# Altium project mightyFan.PrjPCB
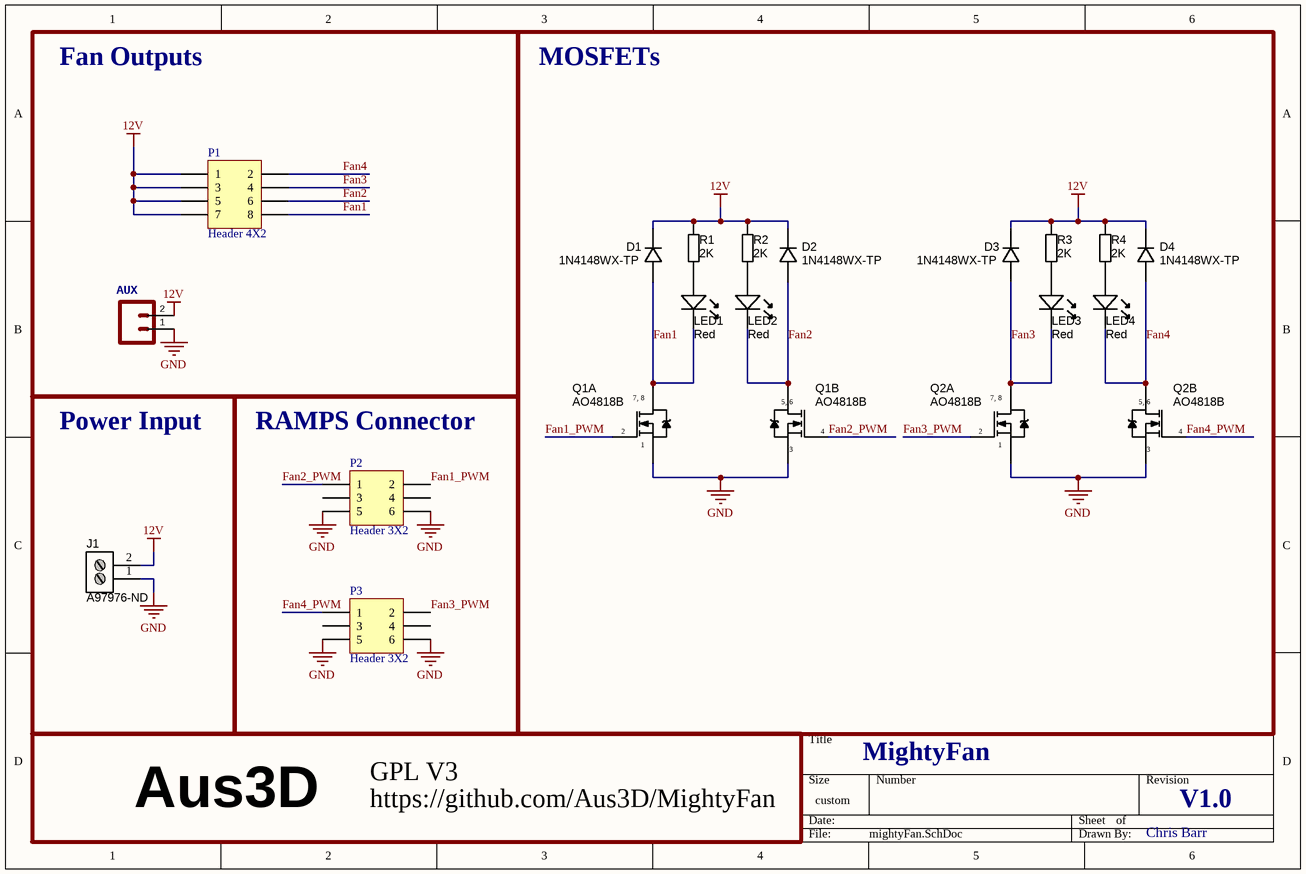
[diagram p0: mightyFan.SchDoc]
1 sheet, 19 parts. Net scope: global (net labels, ports and power ports of the same name join across sheets).
Board file: mightyFan.PcbDoc

## Sheet mightyFan.SchDoc
size 243 x 162 mm; PageSetup: Record=PageOptions|CenterHorizontal=True|CenterVertical=True|PrintScale=1.13|XCorrection=1.00|YCorrection=1.00|PrintKind=0|BorderSize=5000000|LeftOffset=0|BottomOffset=0|Orientation=2|PaperLength=1000|PaperWidth=1000|Scale=100|PaperSource=7|PrintQuality=-3|MediaType=1|DitherType=10|PrintScaleMode=1|PaperKind=Letter|PaperIndex=1

### Parts
AUX  Standard 2-pin 0.1" header. Use with  - straight break away headers ( PRT-00116) - right angle break away headers (PRT-00553) - swiss pins (PRT-00743) - machine pins (PRT-00117) - female headers (PRT-00115)   Molex polarized connector foot print use with: PRT-08233 with associated crimp pins and housings.  2.54_SCREWTERM for use with  PRT-10571.  3.5mm Screw Terminal footprints for  PRT-08084  5mm Screw Terminal footprints for use with PRT-08432  [1X02]  (value not drawn)
D1  Manufacturer Part Number: 1N4148WX-TP  [SOD323]  (hidden comment: DIODE_75V_500mW)
D2  Manufacturer Part Number: 1N4148WX-TP  [SOD323]  (hidden comment: DIODE_75V_500mW)
D3  Manufacturer Part Number: 1N4148WX-TP  [SOD323]  (hidden comment: DIODE_75V_500mW)
D4  Manufacturer Part Number: 1N4148WX-TP  [SOD323]  (hidden comment: DIODE_75V_500mW)
J1  Supplier Part Number 1: A97976-ND  [2P_PCB_ScrewTerm_90S_3.81MM]  (hidden comment: Stackable ScrewTerm)
LED1  Red  [LED-0603-RED]
LED2  Red  [LED-0603-RED]
LED3  Red  [LED-0603-RED]
LED4  Red  [LED-0603-RED]
P1  Header 4X2  [2X4]
P2  Header 3X2  [Header-3x2-female]
P3  Header 3X2  [Header-3x2-female]
Q1  Manufacturer Part Number 1: AO4818B  [SOIC127P600X175-8AN]  (hidden comment: MOSFET_AO4818B)  (parts A,B of 2)
Q2  Manufacturer Part Number 1: AO4818B  [SOIC127P600X175-8AN]  (hidden comment: MOSFET_AO4818B)  (parts A,B of 2)
R1  value 2K  [RESC1608X55N]  (hidden comment: Thick Film)
R2  value 2K  [RESC1608X55N]  (hidden comment: Thick Film)
R3  value 2K  [RESC1608X55N]  (hidden comment: Thick Film)
R4  value 2K  [RESC1608X55N]  (hidden comment: Thick Film)

### Blocks framed on the sheet
Fan Outputs: AUX P1
MOSFETs: D1-D4 LED1-LED4 Q1 Q2 R1-R4
Power Input: J1
RAMPS Connector: P2 P3

### Nets
12V: AUX.2 D1.K D2.K D3.K D4.K J1.2 P1.1 P1.3 P1.5 P1.7 R1.1 R2.1 R3.1 R4.1
GND: AUX.1 J1.1 P2.5 P2.6 P3.5 P3.6 Q1.1(S) Q1.3(S) Q2.1(S) Q2.3(S)
Fan1: D1.A LED1.K P1.8 Q1.7(D) Q1.8(D)
Fan1_PWM: P2.2 Q1.2(G)
Fan2: D2.A LED2.K P1.6 Q1.5(D) Q1.6(D)
Fan2_PWM: P2.1 Q1.4(G)
Fan3: D3.A LED3.K P1.4 Q2.7(D) Q2.8(D)
Fan3_PWM: P3.2 Q2.2(G)
Fan4: D4.A LED4.K P1.2 Q2.5(D) Q2.6(D)
Fan4_PWM: P3.1 Q2.4(G)
NetLED1_A: LED1.A R1.2
NetLED2_A: LED2.A R2.2
NetLED3_A: LED3.A R3.2
NetLED4_A: LED4.A R4.2

Not connected (* = marked no-connect by the designer): P2 3 4; P3 3 4

### Notes on the sheet
- MightyFan
- Aus3D
- https://github.com/Aus3D/MightyFan
- GPL V3
- V1.0
- Chris Barr
- (in symbol MOSFET_AO4818B, part A) 7, 8
- (in symbol MOSFET_AO4818B, part B) 5, 6

### Library data of the parts
AUX = M02PTH
D1-D4 = DIODE_75V_500mW: Diode SMD 300mA 0.5W SOD323; Manufacturer: Micro Commercial Co; Ratings: 75V; 300mA; 0.5W; Material: Si; Diode Type: Standard; Value: Vf=1V @ 50mA; SCDType: source; Package / Case: SOD323; Supplier 1: Digi-Key; Supplier Part Number 1: 1N4148WXTPMSCT-ND
J1 = 2P_ScrewTerm_90S_3.81MM: Terminal Block Screw Type THT 2-Position 3.81mm pitch; Manufacturer 1: Tyco Electronics; Manufacturer Part Number 1: 1776113-2; Value: 2 position; Pitch: 0.150" (3.81mm); Positions Per Level: 2; SCDType: undef; Package / Case: Side Entry; 3.81mm pitch; Category: Connectors Interconnects; Color: Black; Supplier 1: Digi-Key
LED1-LED4 = LED_SMD_Red_0603_220mcd: LED 0603 SMD Hyper Red 630nm 220mcd 20mA; Manufacturer 1: Kingbright Company LLC; Manufacturer Part Number 1: APT1608SURCK; Material: AlGaInP on GaAs; Ratings: 220 mcd; 630 nm; Voltage - Forward (Vf) Typ: 1.95V; Voltage - Forward (Vf) @ 10mA: 1.9V; SCDType: source; Package / Case: 0603 (1608 metric); Supplier 1: Digi-Key; Supplier Part Number 1: 754-1123-1-ND; ComponentLink1URL: http://www.us.kingbright.com/images/catalog/SPEC/APT1608SURCK.pdf; ComponentLink1Description: http://www.us.kingbright.com/images/catalog/SPEC/APT1608SURCK.pdf
P1 = Header 4X2: Header, 4-Pin, Dual row; LatestRevisionDate: 17-Jul-2002; LatestRevisionNote: Re-released for DXP Platform.; Publisher: Altium Limited
P2 P3 = Header 3X2: Header, 3-Pin, Dual row; LatestRevisionDate: 17-Jul-2002; LatestRevisionNote: Re-released for DXP Platform.; Publisher: Altium Limited
Q1 Q2 = MOSFET_AO4818B: MOSFET Dual-Channel 30V 8.5A SOIC-8 SMD; Manufacturer 1: Alpha & Omega Semiconductor Inc; Ratings: 2W; 30V; 8.5A; 16 mOhm; Material: Silicon; SCDType: source; Package / Case: SOIC-8; Supplier 1: Digi-Key; Supplier Part Number 1: 785-1059-1-ND
R1-R4 = RES_330R_0603_5%: Resistor SMD chip 330 Ohm 0.1W 5% 0603; Manufacturer 1: Vishay Dale; Manufacturer Part Number 1: CRCW0603330RJNEA; Ratings: 1/10 W; SCDType: spec; Manufacturer 2: Yageo; Manufacturer Part Number 2: RC0603JR-07330RL; Package / Case: 0603 (1608 metric); Tolerance: ±5%; Material: Thick Film; Supplier 1: Digi-Key; Supplier Part Number 1: 541-330GCT-ND; ComponentLink1URL: http://www.vishay.com/doc?20035; ComponentLink1Description: http://www.vishay.com/doc?20035; Supplier 2: Digi-Key; Supplier Part Number 2: 311-330GRCT-ND; ComponentLink2URL: http://www.yageo.com/documents/recent/PYu-RC0603_51_RoHS_L_4.pdf; ComponentLink2Description: http://www.yageo.com/documents/recent/PYu-RC0603_51_RoHS_L_4.pdf; Supplier: http://au.rs-online.com/web/p/surface-mount-fixed-resistors/6790226/